# Altium schematic sheet CTR-Controller-Rev-A-Sensors-4.SchDoc: CTR Controller - Sensors
size B; Author: TWL; Organization: OLogic, Inc.; DocumentNumber: 112216; Revision: A; SheetNumber: 4; SheetTotal: 4; PageSetup: Record=PageOptions|CenterHorizontal=True|CenterVertical=True|PrintScale=0.72|XCorrection=1.00|YCorrection=1.00|PrintKind=0|BorderSize=5000000|LeftOffset=0|BottomOffset=0|Orientation=2|PaperLength=1000|PaperWidth=1000|Scale=100|PaperSource=15|PrintQuality=600|MediaType=1|DitherType=10|PrintScaleMode=1|PaperKind=Letter|PaperIndex=1
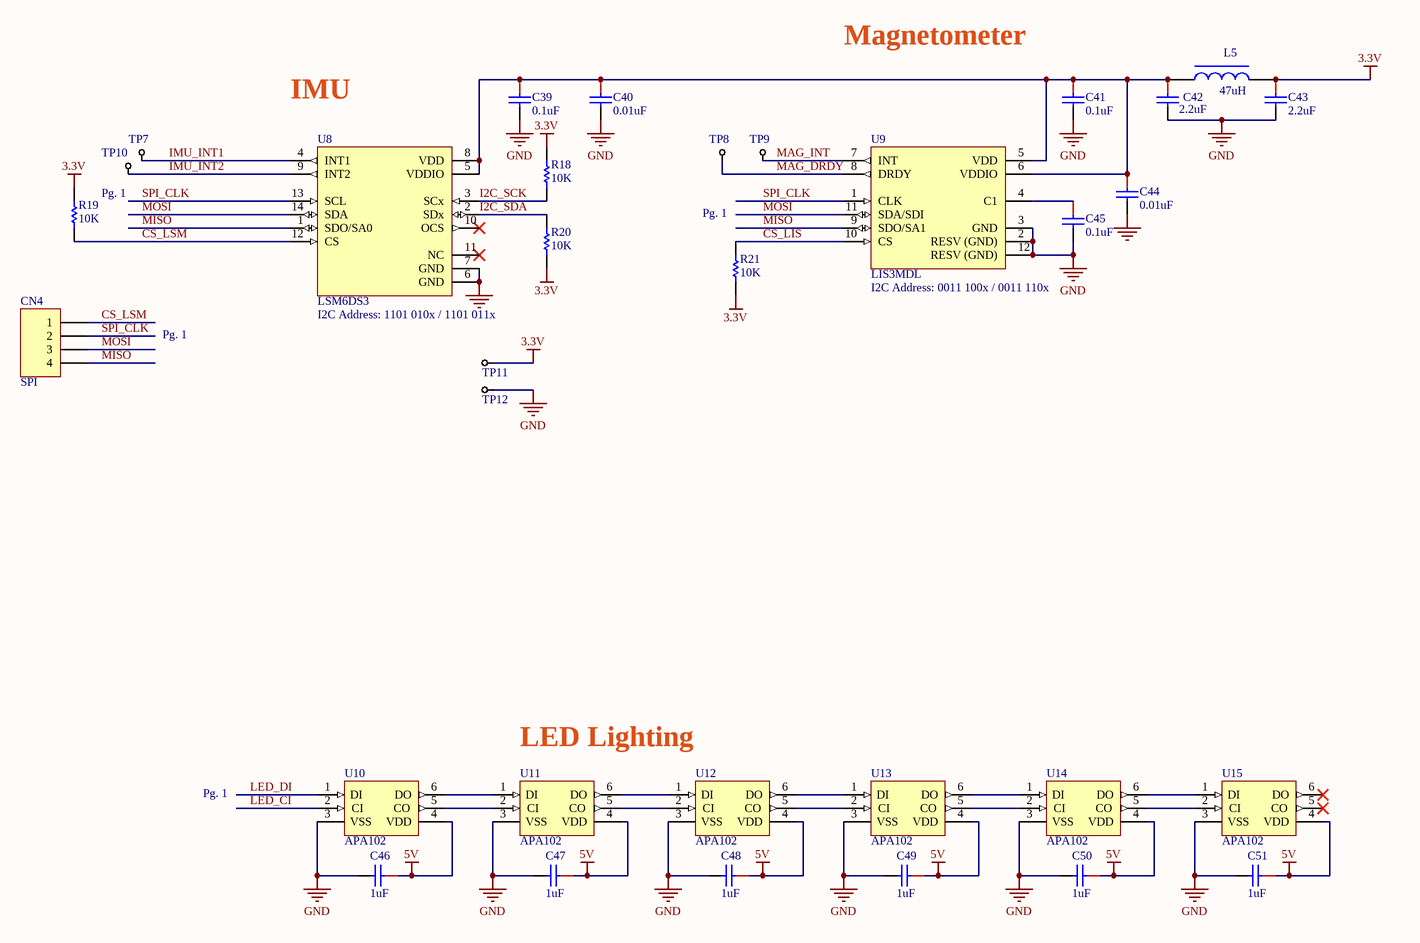
[diagram p0: CTR-Controller-Rev-A-Sensors-4.SchDoc]

## Parts
C39  0.1uF  [CAPC0402(1005)_N]
C40  0.01uF  [CAPC0402(1005)_N]
C41  0.1uF  [CAPC0402(1005)_N]
C42  2.2uF  [CAPC0402(1005)_N]
C43  2.2uF  [CAPC0402(1005)_N]
C44  0.01uF  [CAPC0402(1005)_N]
C45  0.1uF  [CAPC0402(1005)_N]
C46  1uF  [CAPC0402(1005)_N]
C47  1uF  [CAPC0402(1005)_N]
C48  1uF  [CAPC0402(1005)_N]
C49  1uF  [CAPC0402(1005)_N]
C50  1uF  [CAPC0402(1005)_N]
C51  1uF  [CAPC0402(1005)_N]
CN4  SPI  [HDR1X4]
L5  47uH  [IND-2012 Chip]
R18  10K  [RESC0402(1005)_N]
R19  10K  [RESC0402(1005)_N]
R20  10K  [RESC0402(1005)_N]
R21  10K  [RESC0402(1005)_N]
TP7  Test Point  [TestPoint-TH 42 mil]  (value not drawn)
TP8  Test Point  [TestPoint-TH 42 mil]  (value not drawn)
TP9  Test Point  [TestPoint-TH 42 mil]  (value not drawn)
TP10  Test Point  [TestPoint-TH 42 mil]  (value not drawn)
TP11  3V  [TestPoint-TH 35 mil]  (value not drawn)
TP12  GND  [TestPoint-TH 35 mil]  (value not drawn)
U8  I2C Address: 1101 010x / 1101 011x  [LSM6DS3]  (hidden comment: LSM6DS3)
U9  I2C Address: 0011 100x / 0011 110x  [LIS3MDL]  (hidden comment: LIS3MDL)
U10  APA102  [APA102C]
U11  APA102  [APA102C]
U12  APA102  [APA102C]
U13  APA102  [APA102C]
U14  APA102  [APA102C]
U15  APA102  [APA102C]

## Nets
3.3V: C43.1 L5.2 R18.2 R19.2 R20.1 R21.1 TP11.1
5V: C46.1 C47.1 C48.1 C49.1 C50.1 C51.1 U10.4(VDD) U11.4(VDD) U12.4(VDD) U13.4(VDD) U14.4(VDD) U15.4(VDD)
GND: C39.2 C40.2 C41.2 C42.2 C43.2 C44.2 C45.2 C46.2 C47.2 C48.2 C49.2 C50.2 C51.2 TP12.1 U8.6(GND) U8.7(GND) U9.2(RESV_(GND)) U9.3(GND) U9.12(RESV_(GND)) U10.3(VSS) U11.3(VSS) U12.3(VSS) U13.3(VSS) U14.3(VSS) U15.3(VSS)
CS_LIS: R21.2 U9.10(CS)
CS_LSM: CN4.1 R19.1 U8.12(CS)
I2C_SCK: R18.1 U8.3(SCx)
I2C_SDA: R20.2 U8.2(SDx)
IMU_INT1: TP7.1 U8.4(INT1)
IMU_INT2: TP10.1 U8.9(INT2)
LED_CI: U10.2(CI)
LED_DI: U10.1(DI)
MAG_DRDY: TP8.1 U9.8(DRDY)
MAG_INT: TP9.1 U9.7(INT)
MISO: CN4.4 U8.1(SDO/SA0) U9.9(SDO/SA1)
MOSI: CN4.3 U8.14(SDA) U9.11(SDA/SDI)
SPI_CLK: CN4.2 U8.13(SCL) U9.1(CLK)
NetC39_1: C39.1 C40.1 C41.1 C42.1 C44.1 L5.1 U8.5(VDDIO) U8.8(VDD) U9.5(VDD) U9.6(VDDIO)
NetC45_1: C45.1 U9.4(C1)
NetU10_5: U10.5(CO) U11.2(CI)
NetU10_6: U10.6(DO) U11.1(DI)
NetU11_5: U11.5(CO) U12.2(CI)
NetU11_6: U11.6(DO) U12.1(DI)
NetU12_5: U12.5(CO) U13.2(CI)
NetU12_6: U12.6(DO) U13.1(DI)
NetU13_5: U13.5(CO) U14.2(CI)
NetU13_6: U13.6(DO) U14.1(DI)
NetU14_5: U14.5(CO) U15.2(CI)
NetU14_6: U14.6(DO) U15.1(DI)

Not connected (* = marked no-connect by the designer): U8 10(OCS)* 11(NC)*; U15 5(CO)* 6(DO)*

## Notes on the sheet
- Magnetometer
- IMU
- Pg. 1
- LED Lighting
- Title
- By:
- Date:
- Number:
- Time:
- Revision:
- Sheet
- of
- OLogic, Inc.
- 1394 Borregas Ave.
- Sunnyvale, CA
- 94089 USA
- File:
- (650) 996-1490

## Library data of the parts
C39 C41 C45 = CAP CER 0.1UF 50V 10% X7R 0402: 0.1uF 0402 50V; Manufacturer: TDK Corporation; Manufacturer Part Number: CGA2B3X7R1H104K050BB; Capacitance: 0.1µF; Tolerance: ±10%; Temperature Coefficient: X7R; Supplier 1: Digi-Key; RoHS: RoHS Compliant; Category: Capacitors; Stock 1: 1584397; Pricing 1: 1=0.16, 10=0.11, 100=0.0523, 250=0.044, 500=0.03686, 1000=0.03025, 5000=0.02558 (USD); Packaging: Cut Tape (CT); Voltage - Rated: 50V; Mounting Type: Surface Mount, MLCC; Operating Temperature: -55°C ~ 125°C; Applications: Automotive; Ratings: AEC-Q200; Package / Case: 0402 (1005 Metric); Size / Dimension: 0.039" L x 0.020" W (1.00mm x 0.50mm); Height - Seated (Max): -; Thickness (Max): 0.022" (0.55mm); Lead Spacing: -; Features: -; Lead Style: -; ComponentLink1URL: http://product.tdk.com/en/catalog/datasheets/mlcc_automotive_general_en.pdf; ComponentLink1Description: http://product.tdk.com/en/catalog/datasheets/mlcc_automotive_general_en.pdf; Supplier Part Number 1: 445-6899-1-ND; Creator: osman; ClassName: IMU
C40 C44 = CAP CER 0.01UF 25V 10% X5R 0402: 0.01uF 0402; Manufacturer: Murata Electronics North America; Manufacturer Part Number: GRM155R71E103KA01D; Capacitance: 10000pF; Tolerance: ±10%; Voltage - Rated: 25V; Temperature Coefficient: X7R; Supplier 1: Digi-Key; RoHS: RoHS Compliant; Category: Capacitors; Stock 1: 4802323; Pricing 1: 1=0.1, 10=0.012, 50=0.0066, 100=0.0057, 250=0.00464, 500=0.00396, 1000=0.00309, 5000=0.00258 (USD); Packaging: Cut Tape (CT); Mounting Type: Surface Mount, MLCC; Operating Temperature: -55°C ~ 125°C; Applications: General Purpose; Ratings: -; Package / Case: 0402 (1005 Metric); Size / Dimension: 0.039" L x 0.020" W (1.00mm x 0.50mm); Height - Seated (Max): -; Thickness (Max): 0.022" (0.55mm); Lead Spacing: -; Features: -; Lead Style: -; ComponentLink1URL: http://www.murata.com/~/media/webrenewal/support/library/catalog/products/capacitor/mlcc/c02e.ashx; ComponentLink1Description: http://www.murata.com/~/media/webrenewal/support/library/catalog/products/capacitor/mlcc/c02e.ashx; Supplier Part Number 1: 490-1312-1-ND; ClassName: IMU
C42 C43 = CAP CER 2.2UF 35V 10% X5R 0402: 2.2uF 0402; Manufacturer: TDK Corporation; Manufacturer Part Number: C1005X5R1V225K050BC; Tolerance: ±10%; Voltage - Rated: 35V; Temperature Coefficient: X5R; Capacitance: 2.2µF; Supplier 1: Digi-Key; RoHS: RoHS Compliant; Category: Capacitors; Stock 1: 43689; Pricing 1: 1=0.32, 10=0.28, 100=0.14, 250=0.112, 500=0.102, 1000=0.092, 5000=0.076 (USD); Packaging: Cut Tape (CT); Mounting Type: Surface Mount, MLCC; Operating Temperature: -55°C ~ 85°C; Applications: General Purpose; Ratings: -; Package / Case: 0402 (1005 Metric); Size / Dimension: 0.039" L x 0.020" W (1.00mm x 0.50mm); Height - Seated (Max): -; Thickness (Max): 0.022" (0.55mm); Lead Spacing: -; Features: -; Lead Style: -; ComponentLink1URL: http://product.tdk.com/en/catalog/datasheets/mlcc_commercial_general_en.pdf; ComponentLink1Description: http://product.tdk.com/en/catalog/datasheets/mlcc_commercial_general_en.pdf; Creator: osman; Supplier Part Number 1: 445-9028-1-ND; ClassName: IMU
C46-C51 = CAP CER 1UF 16V 10% X5R 0402: 1UF 0402; Manufacturer: TDK Corporation; Manufacturer Part Number: C1005X5R1C105K050BC; Capacitance: 1.0µF; Tolerance: ±10%; Voltage - Rated: 16V; Temperature Coefficient: X5R; ClassName: LED; Supplier 1: Digi-Key; RoHS: RoHS Compliant; Category: Capacitors; Stock 1: 490204; Pricing 1: 1=0.12, 10=0.08, 100=0.038, 250=0.032, 500=0.0268, 1000=0.022, 5000=0.0186 (USD); Packaging: Cut Tape (CT); Mounting Type: Surface Mount, MLCC; Operating Temperature: -55°C ~ 85°C; Applications: General Purpose; Ratings: -; Package / Case: 0402 (1005 Metric); Size / Dimension: 0.039" L x 0.020" W (1.00mm x 0.50mm); Height - Seated (Max): -; Thickness (Max): 0.022" (0.55mm); Lead Spacing: -; Features: -; Lead Style: -; ComponentLink1URL: http://product.tdk.com/en/catalog/datasheets/mlcc_commercial_general_en.pdf; ComponentLink1Description: http://product.tdk.com/en/catalog/datasheets/mlcc_commercial_general_en.pdf; Supplier Part Number 1: 445-4978-1-ND
CN4 = Header 4: Header, 4-Pin; Manufacturer: Sullins Connector Solutions; Manufacturer Part Number: PRPC004SAAN-RC; Connector Type: Header, Unshrouded, Breakaway; Number of Positions: 4; Number of Positions Loaded: All; Pitch: 0.100" (2.54mm); Supplier 1: Digi-Key; RoHS: RoHS Compliant; Category: Connectors, Interconnects; Stock 1: 0; Pricing 1: 1=0.2, 10=0.175, 100=0.1443, 500=0.1141, 1000=0.09794, 5000=0.08935, 10000=0.08591 (USD); Packaging: Bulk; Contact Type: Male Pin; Number of Rows: 1; Row Spacing: -; Contact Mating Length: 0.230" (5.84mm); Mounting Type: Through Hole; Termination: Solder; Fastening Type: -; Features: -; Contact Finish: Gold; Contact Finish Thickness: Flash; Color: Black; ComponentLink1URL: http://media.digikey.com/PDF/Data%20Sheets/Sullins%20PDFs/xRxCzzzSxxN-RC_ST_11635-B.pdf; ComponentLink1Description: http://media.digikey.com/PDF/Data%20Sheets/Sullins%20PDFs/xRxCzzzSxxN-RC_ST_11635-B.pdf; Supplier Part Number 1: S1011EC-04-ND; ClassName: IMU
L5 = INDUCTOR MULTILAYER 47UH 100mA 0805: 47uH 0805; Manufacturer: TDK Corporation; Manufacturer Part Number: MLZ2012M470WT000; Material - Core: Ferrite; Inductance: 47µH; Tolerance: ±20%; Current Rating: 170mA; Current - Saturation: 50mA; Shielding: Shielded; DC Resistance (DCR): 3.7 Ohm; Frequency - Self Resonant: 20MHz; Frequency - Test: 2MHz; Supplier 1: Digi-Key; RoHS: RoHS Compliant; Category: Inductors, Coils, Chokes; Stock 1: 47288; Pricing 1: 1=0.14, 10=0.125, 50=0.0976, 100=0.0875, 500=0.075, 1000=0.065 (USD); Packaging: Cut Tape (CT); Type: Multilayer; Q @ Freq: -; Operating Temperature: -55°C ~ 125°C; Mounting Type: Surface Mount; Package / Case: 0805 (2012 Metric); Size / Dimension: 0.079" L x 0.049" W (2.00mm x 1.25mm); Height - Seated (Max): 0.057" (1.45mm); Supplier Device Package: 0805 (2012 Metric); ComponentLink1URL: http://www.tdk.co.jp/tefe02/e533_mlz.pdf; ComponentLink1Description: http://www.tdk.co.jp/tefe02/e533_mlz.pdf; Supplier Part Number 1: 445-6400-1-ND; ClassName: IMU
R18-R21 = RES 10K OHM 5% 1/10W 0402: 10K 0402; Manufacturer: Panasonic Electronic Components; Manufacturer Part Number: ERJ-2GEJ103X; Tolerance: ±5%; Power (Watts): 0.1W, 1/10W; Temperature Coefficient: ±200ppm/°C; ClassName: IMU; Creator: ted; Supplier 1: Digi-Key; RoHS: RoHS Compliant; Category: Resistors; Stock 1: 5772999; Pricing 1: 1=0.1, 50=0.0106, 100=0.0078, 250=0.00596, 500=0.00476, 1000=0.0035, 5000=0.00251 (USD); Packaging: Cut Tape (CT); Resistance (Ohms): 10k; Composition: Thick Film; Features: Automotive AEC-Q200; Operating Temperature: -55°C ~ 155°C; Package / Case: 0402 (1005 Metric); Supplier Device Package: 0402; Size / Dimension: 0.039" L x 0.020" W (1.00mm x 0.50mm); Height: 0.016" (0.40mm); Number of Terminations: 2; ComponentLink1URL: http://industrial.panasonic.com/www-cgi/jvcr13pz.cgi?E+PZ+3+AOA0001+ERJ2GEJ103X+7+WW; ComponentLink1Description: http://industrial.panasonic.com/www-cgi/jvcr13pz.cgi?E+PZ+3+AOA0001+ERJ2GEJ103X+7+WW; Supplier Part Number 1: P10KJCT-ND
TP7-TP10 = TestPoint, small: ClassName: IMU
TP11 TP12 = TestPoint, small: Test Point; ClassName: IMU
U8 = LSM6DS3: 3D ACC/GYRO INEMO 14VFLGA; Manufacturer: STMicroelectronics; Sensor Type: Accelerometer, Gyroscope, 3 Axis; Output Type: I²C, SPI; Creator: osman; Supplier 1: Digi-Key; RoHS: RoHS Compliant; Category: Sensors, Transducers; Stock 1: 4296; Pricing 1: 1=4.28, 10=3.44, 100=3.06, 250=2.82, 500=2.54, 1000=2.14, 2500=2.03 (USD); ComponentLink1URL: http://www.st.com/web/en/resource/technical/document/datasheet/DM00133076.pdf; ComponentLink1Description: http://www.st.com/web/en/resource/technical/document/datasheet/DM00133076.pdf; Supplier Part Number 1: 497-15383-1-ND; Manufacturer Part Number: LSM6DS3
U9 = LIS3MDL: IC MAGNETOMETER 3-AXIS 12LGA; Manufacturer: STMicroelectronics; Sensing Range: ±4G, ±8G, ±12G, ±16G; Voltage - Supply: 1.9 V ~ 3.6 V; Output Type: I²C, SPI; Creator: osman; Supplier 1: Digi-Key; RoHS: RoHS Compliant; Category: Sensors, Transducers; Stock 1: 5055; Pricing 1: 1=1.53, 10=1.24, 100=0.996, 500=0.873, 1000=0.723, 2500=0.673 (USD); Packaging: *; Type: Compass - Three Axis; Current - Supply: -; Current - Output (Max): -; Features: -; Operating Temperature: -40°C ~ 85°C; Package / Case: 12-VFLGA; Supplier Device Package: *; ComponentLink1URL: http://www.st.com/web/en/resource/technical/document/datasheet/DM00075867.pdf; ComponentLink1Description: http://www.st.com/web/en/resource/technical/document/datasheet/DM00075867.pdf; Supplier Part Number 1: 497-13892-1-ND; Manufacturer Part Number: LIS3MDL
U10-U15 = APA102: APA102 RGB LED with serial controller; Manufacturer: Shiji Lighting; MPN: APA102C; ClassName: LED